# EAGLE design tm-2 (EAGLE 7.5.0)
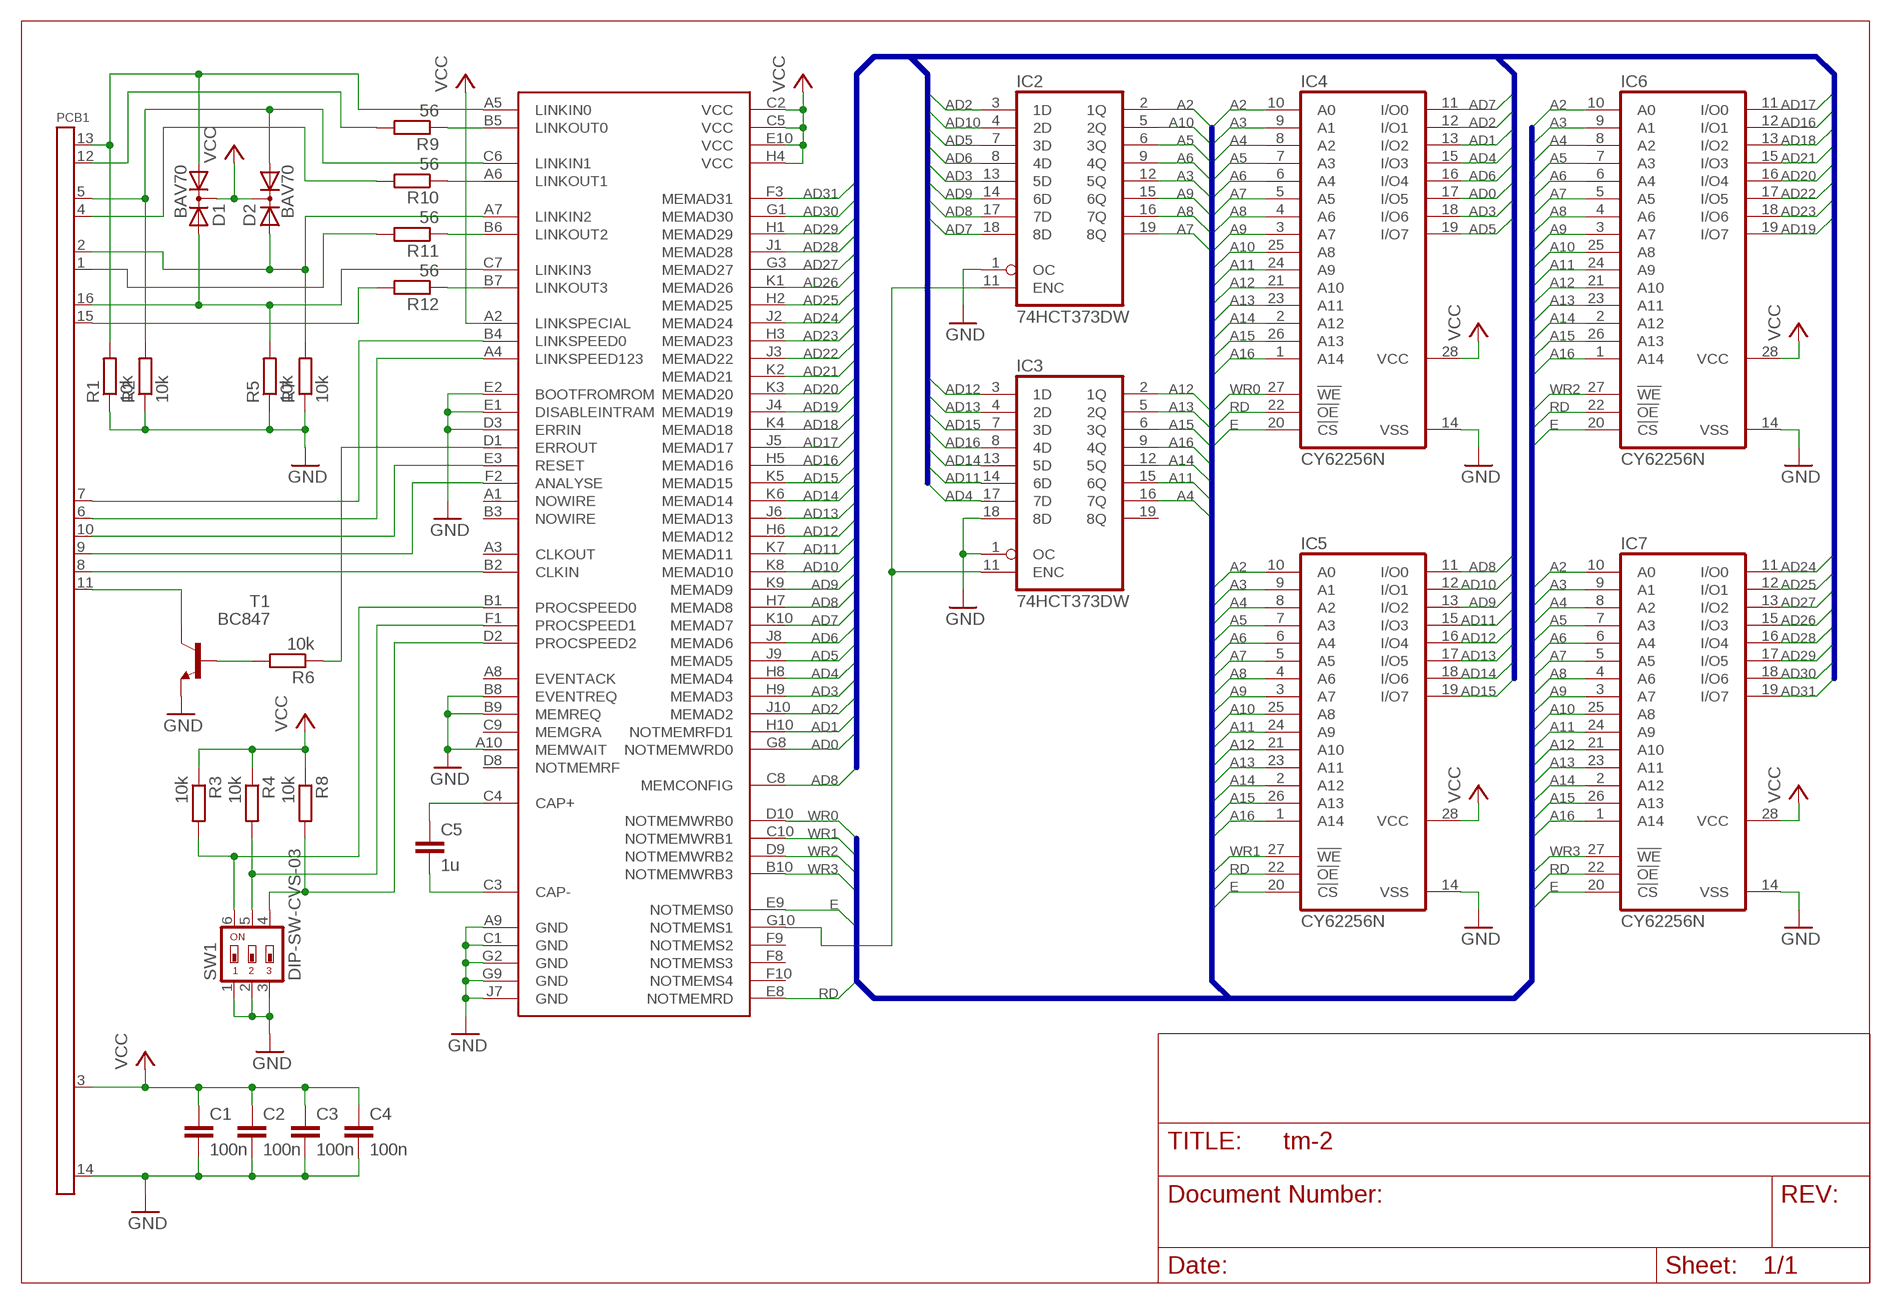
[diagram p0: schematic, sheet 1]

## Parts
C1  100n  C-EUC1206  [C1206]
C2  100n  C-EUC1206  [C1206]
C3  100n  C-EUC1206  [C1206]
C4  100n  C-EUC1206  [C1206]
C5  1u  C-EUC1206  [C1206]
D1  BAV70  DIODE-2AC|CASOT23  [SOT23]
D2  BAV70  DIODE-2AC|CASOT23  [SOT23]
IC1  IMST800  [PGA84]
IC2  74HCT373DW  [SO20W]
IC3  74HCT373DW  [SO20W]
IC4  CY62256N  [SOP28N]
IC5  CY62256N  [SOP28N]
IC6  CY62256N  [SOP28N]
IC7  CY62256N  [SOP28N]
PCB1  TRAM-1-PCB  [TRAM-1-PCB]
R1  10k  R-EU_R1206  [R1206]
R2  10k  R-EU_R1206  [R1206]
R3  10k  R-EU_R1206  [R1206]
R4  10k  R-EU_R1206  [R1206]
R5  10k  R-EU_R1206  [R1206]
R6  10k  R-EU_R1206  [R1206]
R7  10k  R-EU_R1206  [R1206]
R8  10k  R-EU_R1206  [R1206]
R9  56  R-EU_R1206  [R1206]
R10  56  R-EU_R1206  [R1206]
R11  56  R-EU_R1206  [R1206]
R12  56  R-EU_R1206  [R1206]
SW1  DIP-SW-CVS-03  [DIP-SW-CVS-03]
T1  BC847  [SOT23]

## Nets
A2: IC2.2(1Q) IC4.10(A0) IC5.10(A0) IC6.10(A0) IC7.10(A0)
A3: IC2.12(5Q) IC4.9(A1) IC5.9(A1) IC6.9(A1) IC7.9(A1)
A4: IC3.16(7Q) IC4.8(A2) IC5.8(A2) IC6.8(A2) IC7.8(A2)
A5: IC2.6(3Q) IC4.7(A3) IC5.7(A3) IC6.7(A3) IC7.7(A3)
A6: IC2.9(4Q) IC4.6(A4) IC5.6(A4) IC6.6(A4) IC7.6(A4)
A7: IC2.19(8Q) IC4.5(A5) IC5.5(A5) IC6.5(A5) IC7.5(A5)
A8: IC2.16(7Q) IC4.4(A6) IC5.4(A6) IC6.4(A6) IC7.4(A6)
A9: IC2.15(6Q) IC4.3(A7) IC5.3(A7) IC6.3(A7) IC7.3(A7)
A10: IC2.5(2Q) IC4.25(A8) IC5.25(A8) IC6.25(A8) IC7.25(A8)
A11: IC3.15(6Q) IC4.24(A9) IC5.24(A9) IC6.24(A9) IC7.24(A9)
A12: IC3.2(1Q) IC4.21(A10) IC5.21(A10) IC6.21(A10) IC7.21(A10)
A13: IC3.5(2Q) IC4.23(A11) IC5.23(A11) IC6.23(A11) IC7.23(A11)
A14: IC3.12(5Q) IC4.2(A12) IC5.2(A12) IC6.2(A12) IC7.2(A12)
A15: IC3.6(3Q) IC4.26(A13) IC5.26(A13) IC6.26(A13) IC7.26(A13)
A16: IC3.9(4Q) IC4.1(A14) IC5.1(A14) IC6.1(A14) IC7.1(A14)
AD0: IC1.G8(NOTMEMWRD0) IC4.17(I/O5)
AD1: IC1.H10(NOTMEMRFD1) IC4.13(I/O2)
AD2: IC1.J10(MEMAD2) IC2.3(1D) IC4.12(I/O1)
AD3: IC1.H9(MEMAD3) IC2.13(5D) IC4.18(I/O6)
AD4: IC1.H8(MEMAD4) IC3.17(7D) IC4.15(I/O3)
AD5: IC1.J9(MEMAD5) IC2.7(3D) IC4.19(I/O7)
AD6: IC1.J8(MEMAD6) IC2.8(4D) IC4.16(I/O4)
AD7: IC1.K10(MEMAD7) IC2.18(8D) IC4.11(I/O0)
AD8: IC1.C8(MEMCONFIG) IC1.H7(MEMAD8) IC2.17(7D) IC5.11(I/O0)
AD9: IC1.K9(MEMAD9) IC2.14(6D) IC5.13(I/O2)
AD10: IC1.K8(MEMAD10) IC2.4(2D) IC5.12(I/O1)
AD11: IC1.K7(MEMAD11) IC3.14(6D) IC5.15(I/O3)
AD12: IC1.H6(MEMAD12) IC3.3(1D) IC5.16(I/O4)
AD13: IC1.J6(MEMAD13) IC3.4(2D) IC5.17(I/O5)
AD14: IC1.K6(MEMAD14) IC3.13(5D) IC5.18(I/O6)
AD15: IC1.K5(MEMAD15) IC3.7(3D) IC5.19(I/O7)
AD16: IC1.H5(MEMAD16) IC3.8(4D) IC6.12(I/O1)
AD17: IC1.J5(MEMAD17) IC6.11(I/O0)
AD18: IC1.K4(MEMAD18) IC6.13(I/O2)
AD19: IC1.J4(MEMAD19) IC6.19(I/O7)
AD20: IC1.K3(MEMAD20) IC6.16(I/O4)
AD21: IC1.K2(MEMAD21) IC6.15(I/O3)
AD22: IC1.J3(MEMAD22) IC6.17(I/O5)
AD23: IC1.H3(MEMAD23) IC6.18(I/O6)
AD24: IC1.J2(MEMAD24) IC7.11(I/O0)
AD25: IC1.H2(MEMAD25) IC7.12(I/O1)
AD26: IC1.K1(MEMAD26) IC7.15(I/O3)
AD27: IC1.G3(MEMAD27) IC7.13(I/O2)
AD28: IC1.J1(MEMAD28) IC7.16(I/O4)
AD29: IC1.H1(MEMAD29) IC7.17(I/O5)
AD30: IC1.G1(MEMAD30) IC7.18(I/O6)
AD31: IC1.F3(MEMAD31) IC7.19(I/O7)
E: IC1.E9(NOTMEMS0) IC4.20(!CS) IC5.20(!CS) IC6.20(!CS) IC7.20(!CS)
GND: C1.2 C2.2 C3.2 C4.2 IC1.A9(GND) IC1.A10(MEMWAIT) IC1.B8(EVENTREQ) IC1.B9(MEMREQ) IC1.C1(GND) IC1.D3(ERRIN) IC1.E1(DISABLEINTRAM) IC1.E2(BOOTFROMROM) IC1.G2(GND) IC1.G9(GND) IC1.J7(GND) IC2.1(OC) IC3.1(OC) IC3.18(8D) IC4.14(VSS) IC5.14(VSS) IC6.14(VSS) IC7.14(VSS) PCB1.14(GND) R1.1 R2.1 R5.1 R7.1 SW1.1 SW1.2 SW1.3 T1.2(E)
N$1: IC1.G10(NOTMEMS1) IC2.11(ENC) IC3.11(ENC)
N$2: IC1.B5(LINKOUT0) R9.1
N$3: C5.1 IC1.C4(CAP+)
N$4: C5.2 IC1.C3(CAP-)
N$5: IC1.A6(LINKOUT1) R10.1
N$6: IC1.B6(LINKOUT2) R11.1
N$7: IC1.B7(LINKOUT3) R12.1
N$8: PCB1.4(LINK1OUT) R10.2
N$9: PCB1.12(LINK0OUT) R9.2
N$10: D2.2(A2) IC1.A7(LINKIN2) PCB1.2(LINK2IN) R7.2
N$11: D2.1(A1) IC1.C6(LINKIN1) PCB1.5(LINK1IN) R2.2
N$12: D1.1(A1) IC1.A5(LINKIN0) PCB1.13(LINK0IN) R1.2
N$13: PCB1.1(LINK2OUT) R11.2
N$14: D1.2(A2) IC1.C7(LINKIN3) PCB1.16(LINK3IN) R5.2
N$15: PCB1.15(LINK3OUT) R12.2
N$17: IC1.D1(ERROUT) R6.1
N$18: IC1.E3(RESET) PCB1.10(RESET)
N$19: IC1.F2(ANALYSE) PCB1.9(ANALYSE)
N$20: IC1.B2(CLKIN) PCB1.8(CLOCKIN)
N$21: IC1.A4(LINKSPEED123) PCB1.6(LINKSPEEDA)
N$22: IC1.B4(LINKSPEED0) PCB1.7(LINKSPEEDB)
N$23: IC1.B1(PROCSPEED0) R3.2 SW1.6
N$24: PCB1.11(NOTERROR) T1.3(C)
N$25: R6.2 T1.1(B)
N$29: IC1.F1(PROCSPEED1) R4.2 SW1.5
N$30: IC1.D2(PROCSPEED2) R8.2 SW1.4
RD: IC1.E8(NOTMEMRD) IC4.22(!OE) IC5.22(!OE) IC6.22(!OE) IC7.22(!OE)
VCC: C1.1 C2.1 C3.1 C4.1 D1.3(C) D2.3(C) IC1.A2(LINKSPECIAL) IC1.C2(VCC) IC1.C5(VCC) IC1.E10(VCC) IC1.H4(VCC) IC4.28(VCC) IC5.28(VCC) IC6.28(VCC) IC7.28(VCC) PCB1.3(VCC) R3.1 R4.1 R8.1
WR0: IC1.D10(NOTMEMWRB0) IC4.27(!WE)
WR1: IC1.C10(NOTMEMWRB1) IC5.27(!WE)
WR2: IC1.D9(NOTMEMWRB2) IC6.27(!WE)
WR3: IC1.B10(NOTMEMWRB3) IC7.27(!WE)
Unconnected: IC1.A1(NOWIRE) IC1.A3(CLKOUT) IC1.A8(EVENTACK) IC1.B3(NOWIRE) IC1.C9(MEMGRA) IC1.D8(NOTMEMRF) IC1.F8(NOTMEMS3) IC1.F9(NOTMEMS2) IC1.F10(NOTMEMS4) IC3.19(8Q)

## Buses
AD[0..31]
A[2..17],RD,WR[0..3],E

## Power pins joined to a net without a drawn wire
GND: IC2.10(GND) IC3.10(GND)
VCC: IC2.20(VCC) IC3.20(VCC)

## Library data of the parts
C1-C5 = rcl:C-EU: CAPACITOR, European symbol
D1 D2 = diode:DIODE-2AC|CA: Dual DIODE Anode-Cathode|Cathode-Anode
IC1 = Transputer:IMST800
IC2 IC3 = 74xx-eu:74*373: Octal D type transparent LATCH, edge triggered
IC4-IC7 = Transputer:CY62256N
PCB1 = Transputer:TRAM-1-PCB
R1-R12 = rcl:R-EU_: RESISTOR, European symbol
SW1 = Transputer:DIP-SW-CVS-03
T1 = transistor:BC847: NPN TRANSISTOR

## Board
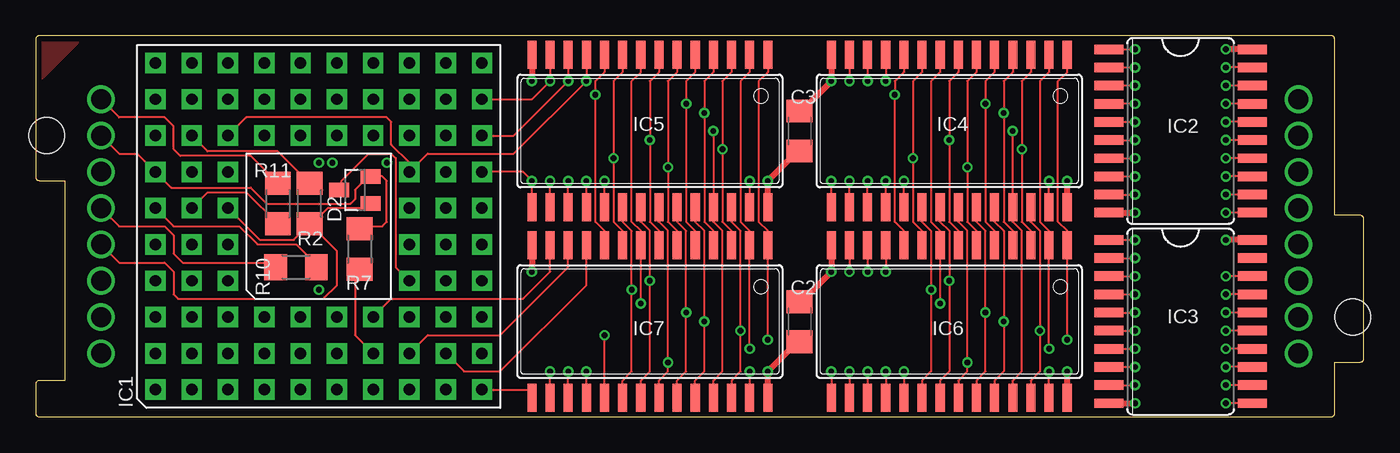
[diagram p1: board, top side]
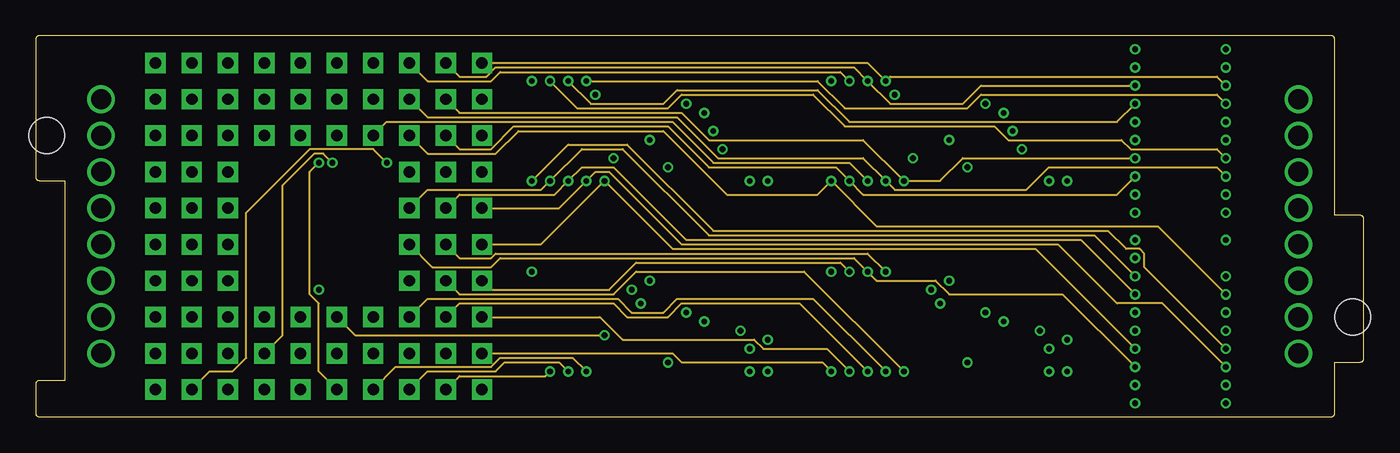
[diagram p2: board, inner layer Route2]
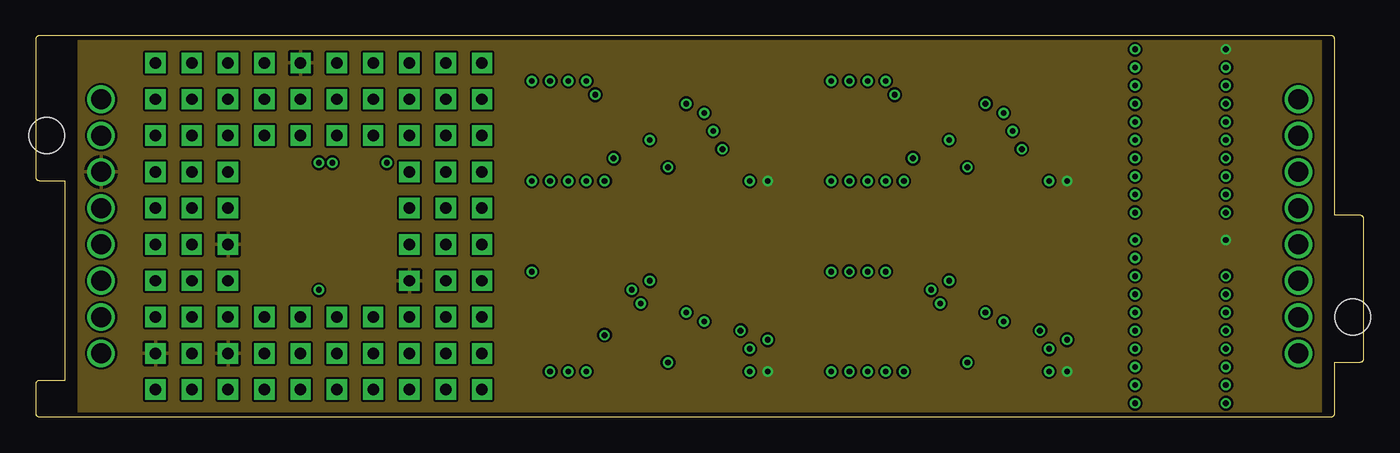
[diagram p3: board, inner layer Route3]
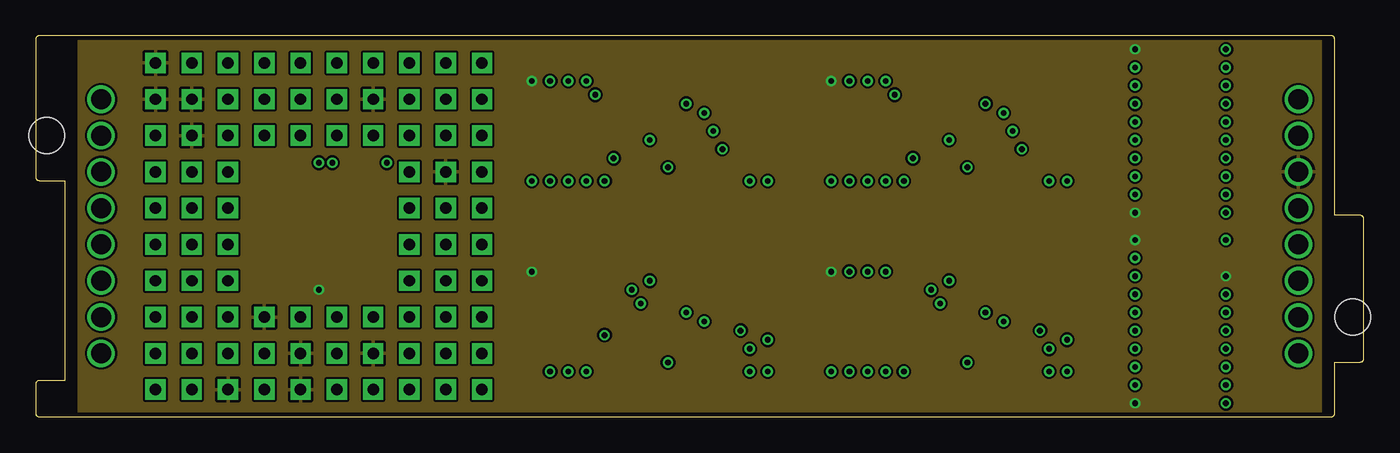
[diagram p4: board, inner layer Route14]
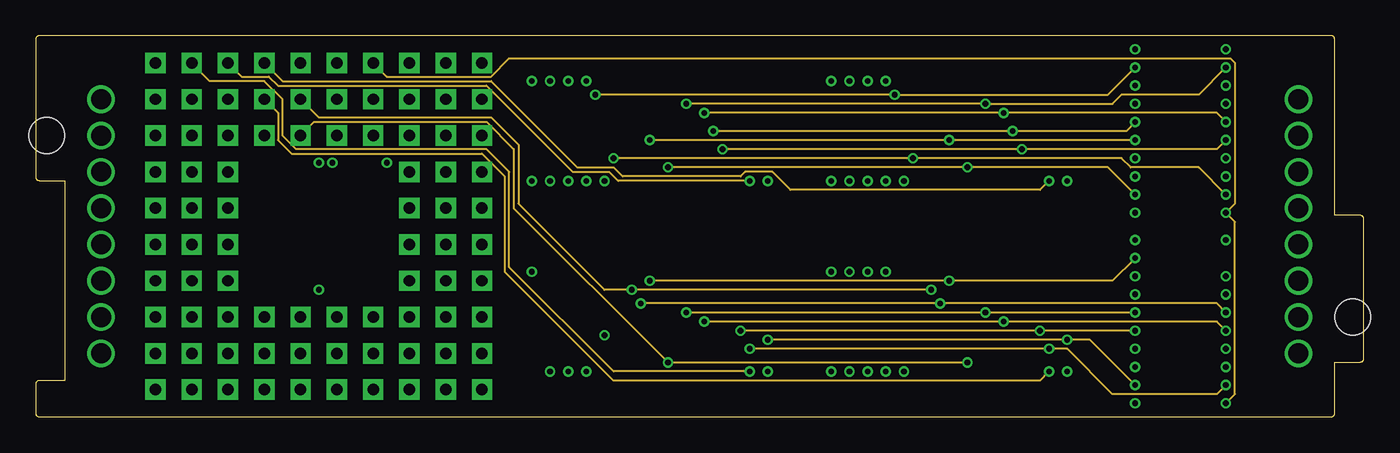
[diagram p5: board, inner layer Route15]
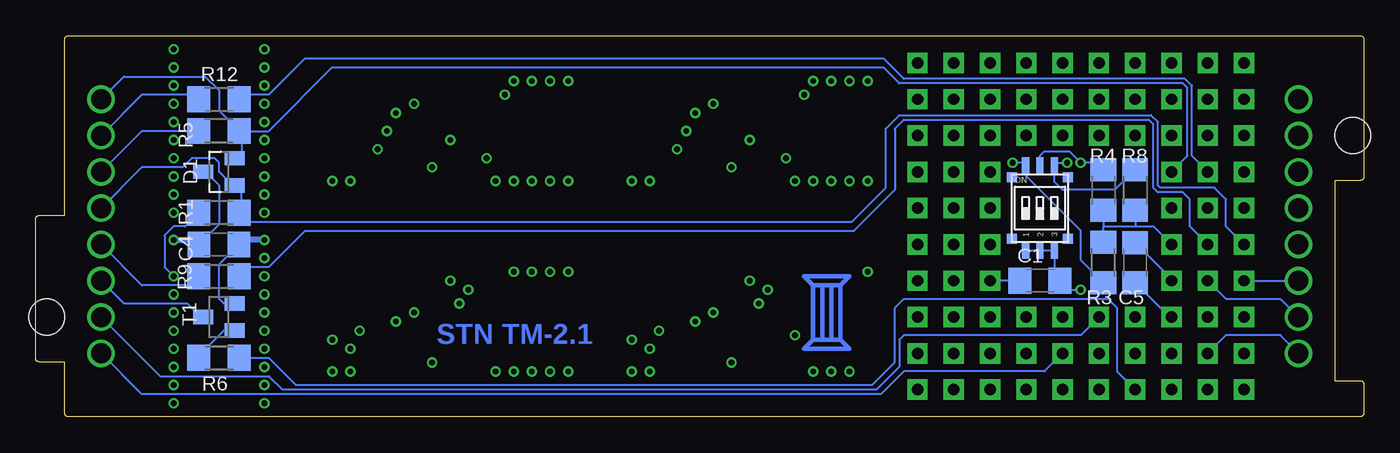
[diagram p6: board, bottom side, seen from below]

Size 92.96 x 26.67 mm. Coordinates in mm from the lower left corner, seen from the top.
Copper layers (1+2+3*14+15+16): Top 0.035mm / dielectric 0.2mm / Route2 0.035mm / dielectric 0.36mm / Route3 0.035mm / dielectric 0.28mm / Route14 0.035mm / dielectric 0.36mm / Route15 0.035mm / dielectric 0.2mm / Bottom 0.035mm
Design rules "PCB-POOL Standard_ML6": minimum track width 0.15mm, minimum drill 0.3mm, track to track 0.15mm, track to pad 0.15mm, pad to pad 0.15mm, via to via 0.15mm, smd to smd 0.15mm, copper to edge 0.3mm, drill to drill 0.2mm, minimum pad ring 0.2mm, minimum via ring 0.15mm, stop-mask expansion 0.03mm, vias tented up to drill 0mil, thermal gap 0.2mm

### Footprints (pad centres in the part's own frame; a part is rotated, then mirrored left to right if it is on the bottom)
C1206 = smd 1.6 x 1.8: 1 -1.4,0; 2 1.4,0
SOT23 = smd 1 x 1.4: 1 -0.95,-1.1; 2 0.95,-1.1; 3 0,1.1
PGA84 = drill 0.8 pad 1.422 square: A1 0,0; A2 2.54,0; A3 5.08,0; A4 7.62,0; A5 10.16,0; A6 12.7,0; A7 15.24,0; A8 17.78,0; A9 20.32,0; A10 22.86,0; B1 0,-2.54; B2 2.54,-2.54; B3 5.08,-2.54; B4 7.62,-2.54; B5 10.16,-2.54; B6 12.7,-2.54; B7 15.24,-2.54; B8 17.78,-2.54; B9 20.32,-2.54; B10 22.86,-2.54; C1 0,-5.08; C2 2.54,-5.08; C3 5.08,-5.08; C4 7.62,-5.08; C5 10.16,-5.08; C6 12.7,-5.08; C7 15.24,-5.08; C8 17.78,-5.08; C9 20.32,-5.08; C10 22.86,-5.08; D1 0,-7.62; D2 2.54,-7.62; D3 5.08,-7.62; D8 17.78,-7.62; D9 20.32,-7.62; D10 22.86,-7.62; E1 0,-10.16; E2 2.54,-10.16; E3 5.08,-10.16; E8 17.78,-10.16; E9 20.32,-10.16; E10 22.86,-10.16; F1 0,-12.7; F2 2.54,-12.7; F3 5.08,-12.7; F8 17.78,-12.7; F9 20.32,-12.7; F10 22.86,-12.7; G1 0,-15.24; G2 2.54,-15.24; G3 5.08,-15.24; G8 17.78,-15.24; G9 20.32,-15.24; G10 22.86,-15.24; H1 0,-17.78; H2 2.54,-17.78; H3 5.08,-17.78; H4 7.62,-17.78; H5 10.16,-17.78; H6 12.7,-17.78; H7 15.24,-17.78; H8 17.78,-17.78; H9 20.32,-17.78; H10 22.86,-17.78; J1 0,-20.32; J2 2.54,-20.32; J3 5.08,-20.32; J4 7.62,-20.32; J5 10.16,-20.32; J6 12.7,-20.32; J7 15.24,-20.32; J8 17.78,-20.32; J9 20.32,-20.32; J10 22.86,-20.32; K1 0,-22.86; K2 2.54,-22.86; K3 5.08,-22.86; K4 7.62,-22.86; K5 10.16,-22.86; K6 12.7,-22.86; K7 15.24,-22.86; K8 17.78,-22.86; K9 20.32,-22.86; K10 22.86,-22.86
SO20W = smd 0.66 x 2.032: 1 -5.715,-5.029; 2 -4.445,-5.029; 3 -3.175,-5.029; 4 -1.905,-5.029; 5 -0.635,-5.029; 6 0.635,-5.029; 7 1.905,-5.029; 8 3.175,-5.029; 9 4.445,-5.029; 10 5.715,-5.029; 11 5.715,5.029; 12 4.445,5.029; 13 3.175,5.029; 14 1.905,5.029; 15 0.635,5.029; 16 -0.635,5.029; 17 -1.905,5.029; 18 -3.175,5.029; 19 -4.445,5.029; 20 -5.715,5.029
SOP28N = smd 0.635 x 1.956: 1 -8.255,-5.334; 2 -6.985,-5.334; 3 -5.715,-5.334; 4 -4.445,-5.334; 5 -3.175,-5.334; 6 -1.905,-5.334; 7 -0.635,-5.334; 8 0.635,-5.334; 9 1.905,-5.334; 10 3.175,-5.334; 11 4.445,-5.334; 12 5.715,-5.334; 13 6.985,-5.334; 14 8.255,-5.334; 15 8.255,5.334; 16 6.985,5.334; 17 5.715,5.334; 18 4.445,5.334; 19 3.175,5.334; 20 1.905,5.334; 21 0.635,5.334; 22 -0.635,5.334; 23 -1.905,5.334; 24 -3.175,5.334; 25 -4.445,5.334; 26 -5.715,5.334; 27 -6.985,5.334; 28 -8.255,5.334
TRAM-1-PCB = drill 1.4 pad 1.93: 1 -17.78,0; 2 -15.24,0; 3 -12.7,0; 4 -10.16,0; 5 -7.62,0; 6 -5.08,0; 7 -2.54,0; 8 0,0; 9 0,83.82; 10 -2.54,83.82; 11 -5.08,83.82; 12 -7.62,83.82; 13 -10.16,83.82; 14 -12.7,83.82; 15 -15.24,83.82; 16 -17.78,83.82 | hole 2.5: -15.24,-3.81; -2.54,87.63
R1206 = smd 1.6 x 1.803: 1 -1.422,0; 2 1.422,0
DIP-SW-CVS-03 = smd 0.5 x 1.2: 1 -1,-2.95; 2 0,-2.95; 3 1,-2.95; 4 1,2.95; 5 0,2.95; 6 -1,2.95 | smd 0.7 x 0.7: P$1 -1.95,-2.15; P$2 -1.95,2.15; P$3 1.95,2.15; P$4 1.95,-2.15

### Placement (x,y rotation side)
C1  22.67,9.53 0 bottom
C2  53.47,6.67 90 top
C3  53.47,20 90 top
C4  80.14,12.07 0 bottom
C5  16,10.79 270 bottom
D1  80.14,17.14 90 bottom
D2  22.35,15.88 90 top
IC1  8.38,1.91 90 top
IC2  80.14,20 270 top
IC3  80.14,6.67 270 top
IC4  63.94,20 180 top
IC5  42.99,20 180 top
IC6  63.94,6.67 180 top
IC7  42.99,6.67 180 top
PCB1  4.57,4.45 270 top
R1  80.14,14.29 0 bottom
R2  19.18,14.92 270 top
R3  18.22,10.79 270 bottom
R4  18.22,15.88 90 bottom
R5  80.14,20 0 bottom
R6  80.14,4.13 180 bottom
R7  22.67,11.75 90 top
R8  16,15.88 90 bottom
R9  80.14,9.84 180 bottom
R10  18.22,10.48 180 top
R11  16.95,14.92 90 top
R12  80.14,22.23 180 bottom
SW1  22.67,14.61 0 bottom
T1  80.14,6.99 90 bottom
U$2  [LOGO]  37.59,7.3 0 bottom

### Tracks (layer width: path | path; a pad name or v marks a point on that pad's centre or on a via)
A2  (via drill 0.4)
  Top 0.152: IC2.2 v76.96,24.45 | IC5.10 39.81,24.13 39.18,23.5 v39.18,22.54 39.18,13.65 39.81,13.02 IC7.10 | IC4.10 60.77,24.13 60.13,23.5 v60.13,22.54 60.13,13.65 60.77,13.02 IC6.10
  Route15 0.152: v76.96,24.45 75.06,22.54 v60.13,22.54 v39.18,22.54
A3  (via drill 0.4)
  Top 0.152: IC2.12 v83.31,15.56 | IC5.9 41.09,24.13 40.45,23.5 v40.45,18.1 40.45,13.65 41.09,13.02 IC7.9 | IC4.9 62.04,24.13 61.41,23.5 v61.41,18.1 61.41,13.65 62.04,13.02 IC6.9
  Route15 0.152: v83.31,15.56 81.41,17.46 76.64,17.46 76.01,18.1 v61.41,18.1 v40.45,18.1
A4  (via drill 0.4)
  Top 0.152: IC3.16 v83.31,7.3 | IC4.8 63.31,24.13 62.67,23.5 62.67,13.65 63.31,13.02 IC6.8 v63.31,7.94 | v42.35,7.94 IC7.8 42.35,13.02 41.72,13.65 41.72,23.5 42.35,24.13 IC5.8
  Route15 0.152: v83.31,7.3 82.68,7.94 v63.31,7.94 v42.35,7.94
A5  (via drill 0.4)
  Top 0.152: IC2.6 v76.96,19.37 | IC5.7 43.62,24.13 42.99,23.5 v42.99,19.37 42.99,13.65 43.62,13.02 IC7.7 | IC4.7 64.58,24.13 63.95,23.5 v63.95,19.37 63.95,13.65 64.58,13.02 IC6.7
  Route15 0.152: v76.96,19.37 v63.95,19.37 v42.99,19.37
A6  (via drill 0.4)
  Top 0.152: IC2.9 v76.96,15.56 | IC5.6 44.89,24.13 44.26,23.5 v44.26,17.46 44.26,13.65 44.89,13.02 IC7.6 | IC4.6 65.85,24.13 65.21,23.5 v65.21,17.46 65.21,13.65 65.85,13.02 IC6.6
  Route15 0.152: v76.96,15.56 75.06,17.46 v65.21,17.46 v44.26,17.46
A7  (via drill 0.4)
  Top 0.152: IC2.19 v83.31,24.45 | IC5.5 46.17,24.13 45.53,23.5 v45.53,21.91 45.53,13.65 46.17,13.02 IC7.5 | IC4.5 67.12,24.13 66.48,23.5 v66.48,21.91 66.48,13.65 67.12,13.02 IC6.5
  Route15 0.152: v83.31,24.45 81.41,22.54 76.01,22.54 75.37,21.91 v66.48,21.91 v45.53,21.91
A8  (via drill 0.4)
  Top 0.152: IC2.16 v83.31,20.64 | IC5.4 47.43,24.13 46.8,23.5 v46.8,21.27 46.8,13.65 47.43,13.02 IC7.4 | IC4.4 68.39,24.13 67.75,23.5 v67.75,21.27 67.75,13.65 68.39,13.02 IC6.4
  Route15 0.152: v83.31,20.64 82.68,21.27 v67.75,21.27 v46.8,21.27
A9  (via drill 0.4)
  Top 0.152: IC2.15 v83.31,19.37 | IC5.3 48.71,24.13 48.07,23.5 v48.07,18.73 48.07,13.65 48.71,13.02 IC7.3 | IC4.3 69.66,24.13 69.03,23.5 v69.03,18.73 69.03,13.65 69.66,13.02 IC6.3
  Route15 0.152: v83.31,19.37 82.68,18.73 v69.03,18.73 v48.07,18.73
A10  (via drill 0.4)
  Top 0.152: IC2.5 v76.96,20.64 | IC7.25 47.43,2.54 48.07,3.18 48.07,13.02 47.43,13.65 IC5.25 v47.43,20 | IC6.25 68.39,2.54 69.03,3.18 69.03,13.02 68.39,13.65 IC4.25 v68.39,20
  Route15 0.152: v76.96,20.64 76.33,20 v68.39,20 v47.43,20
A11  (via drill 0.4)
  Top 0.152: IC3.15 v83.31,6.03 | IC5.24 46.17,13.65 46.8,13.02 v46.8,6.67 46.8,3.18 46.17,2.54 IC7.24 | IC4.24 67.12,13.65 67.75,13.02 v67.75,6.67 67.75,3.18 67.12,2.54 IC6.24
  Route15 0.152: v83.31,6.03 82.68,6.67 v67.75,6.67 v46.8,6.67
A12  (via drill 0.4)
  Top 0.152: IC3.2 v76.96,11.11 | IC5.21 42.35,13.65 42.99,13.02 v42.99,9.53 42.99,3.18 42.35,2.54 IC7.21 | IC4.21 63.31,13.65 63.95,13.02 v63.95,9.53 63.95,3.18 63.31,2.54 IC6.21
  Route15 0.152: v76.96,11.11 75.37,9.53 v63.95,9.53 v42.99,9.53
A13  (via drill 0.4)
  Top 0.152: IC3.5 v76.96,7.3 | IC5.23 44.89,13.65 45.53,13.02 v45.53,7.3 45.53,3.18 44.89,2.54 IC7.23 | IC4.23 65.85,13.65 66.48,13.02 v66.48,7.3 66.48,3.18 65.85,2.54 IC6.23
  Route15 0.152: v76.96,7.3 v66.48,7.3 v45.53,7.3
A14  (via drill 0.4)
  Top 0.152: IC3.12 v83.31,2.22 | IC4.2 70.93,24.13 70.29,23.5 70.29,13.65 70.93,13.02 IC6.2 v70.93,4.76 | v49.98,4.76 IC7.2 49.98,13.02 49.34,13.65 49.34,23.5 49.98,24.13 IC5.2
  Route15 0.152: v83.31,2.22 82.68,1.59 75.37,1.59 72.2,4.76 v70.93,4.76 v49.98,4.76
A15  (via drill 0.4)
  Top 0.152: IC3.6 v76.96,6.03 | IC5.26 48.71,13.65 49.34,13.02 v49.34,6.03 49.34,3.18 48.71,2.54 IC7.26 | IC4.26 69.66,13.65 70.29,13.02 v70.29,6.03 70.29,3.18 69.66,2.54 IC6.26
  Route15 0.152: v76.96,6.03 v70.29,6.03 v49.34,6.03
A16  (via drill 0.4)
  Top 0.152: IC3.9 v76.96,2.22 | IC4.1 72.2,24.13 71.56,23.5 71.56,13.65 72.2,13.02 IC6.1 v72.2,5.4 | v51.24,5.4 IC7.1 51.24,13.02 50.61,13.65 50.61,23.5 51.24,24.13 IC5.1
  Route15 0.152: v76.96,2.22 73.79,5.4 v72.2,5.4 v51.24,5.4
AD0  (via drill 0.4)
  Top 0.152: IC4.17 v58.23,16.51
  Route2 0.152: IC1.G8 24.57,20.64 44.58,20.64 47.43,17.78 56.96,17.78 v58.23,16.51
AD1  (via drill 0.4)
  Top 0.152: IC4.13 v56.96,23.5
  Route2 0.152: IC1.H10 27.43,23.5 31.88,23.5 32.51,24.13 56.32,24.13 v56.96,23.5
AD2  (via drill 0.4)
  Top 0.152: v76.96,23.18 IC2.3 | IC4.12 v58.23,23.5
  Route2 0.152: IC1.J10 29.65,23.81 31.56,23.81 32.19,24.45 57.28,24.45 v58.23,23.5 59.82,21.91 64.9,21.91 66.17,23.18 v76.96,23.18
AD3  (via drill 0.4)
  Top 0.152: IC2.13 v83.31,16.83 | IC4.18 v59.5,16.51
  Route2 0.152: IC1.H9 27.43,20.96 44.89,20.96 47.75,18.1 57.91,18.1 v59.5,16.51 60.13,15.88 69.34,15.88 70.93,17.46 82.68,17.46 v83.31,16.83
AD4  (via drill 0.4)
  Top 0.152: IC3.17 v83.31,8.57 | IC4.15 v55.69,16.51
  Route2 0.152: IC1.H8 27.43,18.41 32.19,18.41 33.78,20 43.94,20 48.39,15.56 54.74,15.56 v55.69,16.51 58.86,13.34 78.55,13.34 v83.31,8.57
AD5  (via drill 0.4)
  Top 0.152: IC2.7 v76.96,18.1 | IC4.19 v60.77,16.51
  Route2 0.152: IC1.J9 29.65,21.27 45.21,21.27 47.12,19.37 57.91,19.37 v60.77,16.51 63.31,16.51 64.9,18.1 v76.96,18.1
AD6  (via drill 0.4)
  Top 0.152: IC2.8 v76.96,16.83 | IC4.16 v56.96,16.51
  Route2 0.152: IC1.J8 29.65,18.73 31.88,18.73 33.46,20.32 44.26,20.32 47.12,17.46 56.01,17.46 v56.96,16.51 57.91,15.56 75.69,15.56 v76.96,16.83
AD7  (via drill 0.4)
  Top 0.152: IC2.18 v83.31,23.18 | IC4.11 v59.5,23.5
  Route2 0.152: IC1.K10 58.23,24.77 v59.5,23.5 59.82,23.81 82.68,23.81 v83.31,23.18
AD8  (via drill 0.4)
  Top 0.152: IC1.C8 14.73,20.96 24.57,20.96 24.89,20.64 24.89,19.05 26.16,17.78 IC1.H7 27.43,18.41 33.46,18.41 v38.54,23.5 IC5.11 | IC2.17 v83.31,21.91
  Route2 0.152: v38.54,23.5 54.74,23.5 56.64,21.59 65.21,21.59 66.17,22.54 82.68,22.54 v83.31,21.91
AD9  (via drill 0.4)
  Top 0.152: IC1.K9 34.73,22.23 v36.01,23.5 IC5.13 | IC2.14 v83.31,18.1
  Route2 0.152: v36.01,23.5 37.91,21.59 44.26,21.59 45.21,22.54 54.42,22.54 56.64,20.32 67.12,20.32 68.07,19.37 76.01,19.37 76.64,18.73 82.68,18.73 v83.31,18.1
AD10  (via drill 0.4)
  Top 0.152: IC1.K8 33.46,19.69 v37.28,23.5 IC5.12 | v76.96,21.91 IC2.4
  Route2 0.152: v37.28,23.5 38.86,21.91 43.94,21.91 44.89,22.86 54.74,22.86 56.96,20.64 75.69,20.64 v76.96,21.91
AD11  (via drill 0.4)
  Top 0.152: IC1.K7 34.1,17.14 v34.73,16.51 IC5.15 | IC3.14 v83.31,4.76
  Route2 0.152: v34.73,16.51 37.28,19.05 41.4,19.05 47.43,13.02 75.06,13.02 76.33,11.75 77.28,11.75 77.6,11.43 77.6,10.48 v83.31,4.76
AD12  (via drill 0.4)
  Top 0.152: IC3.3 v76.96,9.84 | IC5.16 v36.01,16.51
  Route2 0.152: IC1.H6 27.43,15.88 35.37,15.88 v36.01,16.51 38.23,18.73 41.09,18.73 47.12,12.7 74.1,12.7 v76.96,9.84
AD13  (via drill 0.4)
  Top 0.152: IC3.4 v76.96,8.57 | IC5.17 v37.28,16.51
  Route2 0.152: IC1.J6 29.65,15.56 36.32,15.56 v37.28,16.51 38.23,17.46 40.45,17.46 45.53,12.38 73.15,12.38 v76.96,8.57
AD14  (via drill 0.4)
  Top 0.152: IC3.13 v83.31,3.49 | IC5.18 v38.54,16.51
  Route2 0.152: IC1.K6 36.64,14.61 v38.54,16.51 39.18,17.14 40.13,17.14 45.21,12.07 71.56,12.07 75.69,7.94 78.87,7.94 v83.31,3.49
AD15  (via drill 0.4)
  Top 0.152: IC3.7 v76.96,4.76 | IC5.19 v39.81,16.51
  Route2 0.152: IC1.K5 35.37,12.07 v39.81,16.51 44.58,11.75 69.98,11.75 v76.96,4.76
AD16  (via drill 0.4)
  Top 0.152: IC3.8 v76.96,3.49 | IC6.12 v58.23,10.16
  Route2 0.152: IC1.H5 27.75,10.48 31.88,10.48 32.51,11.11 57.28,11.11 v58.23,10.16 58.86,9.53 62.99,9.53 63.95,8.57 71.88,8.57 v76.96,3.49
AD17  (via drill 0.4)
  Top 0.152: IC6.11 v59.5,10.16
  Route2 0.152: IC1.J5 29.65,11.11 31.88,11.11 32.19,11.43 58.23,11.43 v59.5,10.16
AD18  (via drill 0.4)
  Top 0.152: IC6.13 v56.96,10.16
  Route2 0.152: IC1.K4 31.88,8.89 40.13,8.89 42.04,10.79 56.32,10.79 v56.96,10.16
AD19  (via drill 0.4)
  Top 0.152: v60.77,3.18 IC6.19
  Route2 0.152: IC1.J4 29.65,8.57 40.45,8.57 42.04,10.16 53.78,10.16 v60.77,3.18
AD20  (via drill 0.4)
  Top 0.152: v56.96,3.18 IC6.16
  Route2 0.152: IC1.K3 39.5,6.99 41.09,5.4 50.29,5.4 50.93,4.76 55.37,4.76 v56.96,3.18
AD21  (via drill 0.4)
  Top 0.152: v55.69,3.18 IC6.15
  Route2 0.152: IC1.K2 44.58,4.45 45.21,3.81 55.05,3.81 v55.69,3.18
AD22  (via drill 0.4)
  Top 0.152: v58.23,3.18 IC6.17
  Route2 0.152: IC1.J3 29.65,7.94 40.45,7.94 41.4,6.99 44.26,6.99 45.21,7.94 53.47,7.94 v58.23,3.18
AD23  (via drill 0.4)
  Top 0.152: v59.5,3.18 IC6.18
  Route2 0.152: IC1.H3 27.43,8.26 40.77,8.26 41.72,7.3 43.94,7.3 44.89,8.26 54.42,8.26 v59.5,3.18
AD24
  Top 0.152: IC1.J2 29.97,3.18 32.51,3.18 38.54,9.21 IC7.11
AD25
  Top 0.152: IC1.H2 27.43,5.71 32.51,5.71 37.28,10.48 IC7.12
AD26
  Top 0.152: IC1.K1 34.73,1.91 IC7.15
AD27
  Top 0.152: IC1.G3 24.89,8.26 34.1,8.26 36.01,10.16 IC7.13
AD28  (via drill 0.4)
  Top 0.152: IC7.16 v36.01,3.18
  Route2 0.152: IC1.J1 29.65,2.86 35.69,2.86 v36.01,3.18
AD29  (via drill 0.4)
  Top 0.152: IC7.17 v37.28,3.18
  Route2 0.152: IC1.H1 27.43,3.18 32.19,3.18 32.83,3.81 36.64,3.81 v37.28,3.18
AD30  (via drill 0.4)
  Top 0.152: IC7.18 v38.54,3.18
  Route2 0.152: IC1.G1 25.21,3.49 31.88,3.49 32.51,4.13 37.59,4.13 v38.54,3.18
AD31  (via drill 0.4)
  Top 0.152: IC7.19 v39.81,5.71
  Route2 0.152: IC1.F3 22.35,5.71 v39.81,5.71
E  (via drill 0.4)
  Top 0.152: IC5.20 41.09,13.65 41.72,13.02 v41.72,8.89 41.72,3.18 41.09,2.54 IC7.20 | IC4.20 62.04,13.65 62.67,13.02 v62.67,8.89 62.67,3.18 62.04,2.54 IC6.20
  Route15 0.152: v62.67,8.89 v41.72,8.89 39.81,8.89 33.78,14.92 33.78,19.05 31.88,20.96 19.81,20.96 IC1.E9
GND  (via drill 0.4)
  Top 0.152: 53.47,8.26 C2.2 53.6,8.07 | 53.6,21.4 C3.2 | IC3.1 v76.96,12.38 | IC3.18 v83.31,9.84 | IC2.1 v76.96,25.72 | IC1.B8 12.03,18.57 16.95,18.57 R2.1 | R7.1 22.35,10.01 22.35,5.71 IC1.G2
  Top 0.406: 53.6,21.4 v55.69,23.5 IC4.14 | 53.6,8.07 v55.69,10.16 IC6.14 | IC2.10 v76.96,14.29 | IC3.10 v76.96,0.95 | IC5.14 v34.73,23.5 | IC7.14 v34.73,10.16
  Bottom 0.152: 78.23,12.38 78.55,12.07 C4.2 80.14,10.66 80.14,8.26 79.82,7.94 T1.2 | R1.1 82.51,13.34 83.31,13.34 83.95,12.7 83.95,10.48 v83.31,9.84 | R5.1 85.53,20 PCB1.14 | 20.45,8.89 v19.81,8.89 20.63,8.89 C1.2 21.67,9.93 SW1.3 SW1.2 SW1.1
  Bottom 0.406: v76.96,12.38 78.23,12.38
  pour Route14 (isolate 0.127): 2.98,0 89.98,0 89.98,26.67 2.98,26.67
N$1  (via drill 0.4)
  Top 0.152: IC2.11 v83.31,14.29 | IC3.11 v83.31,0.95
  Route15 0.152: IC1.G10 24.57,23.81 31.88,23.81 33.15,25.08 83.63,25.08 83.95,24.77 83.95,14.92 v83.31,14.29 83.95,13.65 83.95,1.59 v83.31,0.95
N$2
  Bottom 0.152: 78.08,9.21 R9.1 78.72,10.31 78.55,10.48 76.64,10.48 74.1,13.02 35.69,13.02 32.83,15.88 32.83,20.16 32.19,20.8 15.05,20.8 14.73,20.48 14.73,16.03 14.41,15.72 12.67,15.72 12.19,15.24 12.19,13.34 IC1.B5
N$3
  Bottom 0.152: C5.1 13.46,9.66 IC1.C4
N$4
  Bottom 0.152: C5.2 13.59,6.99 IC1.C3
N$5
  Top 0.152: IC1.A6 9.65,13.34 14.26,13.34 15.53,12.07 18.22,12.07 19.65,10.64 R10.1
N$6
  Top 0.152: IC1.B6 12.03,15.72 14.74,15.72 R11.1
N$7
  Bottom 0.152: IC1.B7 12.03,18.26 12.03,23.18 12.51,23.65 32.19,23.65 33.62,25.08 74.1,25.08 76.64,22.54 78.23,22.54 78.55,22.23 R12.1
N$8
  Top 0.152: PCB1.4 5.84,13.34 9.02,13.34 9.65,12.7 9.65,11.43 10.29,10.79 16.48,10.79 R10.2
N$9
  Bottom 0.152: R9.2 82.19,9.21 85.53,9.21 PCB1.12
N$10
  Top 0.152: PCB1.2 5.84,18.41 7.11,18.41 IC1.A7 9.49,16.03 15.05,16.03 16.16,14.92 22.03,14.92 22.35,15.24 22.35,15.88 23.3,16.83 D2.2 24.26,16.83 24.57,16.51 24.57,13.65 24.26,13.34 23.15,13.34 22.99,13.17 R7.2
N$11
  Top 0.152: D2.1 23.13,14.61 20.45,14.61 19.34,13.5 R2.2 | IC1.C6 15.68,12.38 18.06,12.38 R2.2 | PCB1.5 5.84,10.79 9.02,10.79 9.65,10.16 9.65,8.57 9.97,8.26 20.13,8.26 21.08,9.21 21.08,11.6 R2.2
N$12
  Bottom 0.152: PCB1.13 85.53,17.46 82.68,17.46 82.04,18.1 80.45,18.1 80.14,17.78 80.14,17.14 79.18,16.19 D1.1 78.55,16.2 78.55,16.19 78.55,14.92 78.08,14.92 R1.2 78.72,14.14 78.23,13.65 35.85,13.65 33.46,16.03 33.46,20.16 32.51,21.11 14.89,21.11 14.41,20.64 14.41,16.19 14.26,16.03 10.45,16.03 9.65,15.24 9.65,13.34 IC1.A5
N$13
  Top 0.152: R11.2 15.04,18.26 10.13,18.26 9.65,18.73 9.65,20.32 9.02,20.96 5.84,20.96 PCB1.1
N$14
  Bottom 0.152: D1.2 78.87,18.09 78.55,18.41 78.55,19.84 R5.2 | IC1.C7 12.35,18.26 12.35,23.02 12.67,23.34 32.51,23.34 33.62,24.45 72.2,24.45 76.64,20 R5.2 | PCB1.16 86.81,23.81 81.09,23.81 80.14,22.86 80.14,21.43 R5.2
N$15
  Bottom 0.152: R12.2 81.88,22.54 85.53,22.54 PCB1.15
N$16
  pour Top: 0.44,26.19 0.44,23.65 2.98,26.19
N$17
  Bottom 0.152: R6.1 76.64,4.13 74.74,2.22 34.42,2.22 32.83,3.81 32.83,7.62 32.19,8.26 17.91,8.26 17.27,7.62 17.27,3.18 IC1.D1
N$18
  Bottom 0.152: IC1.E3 19.81,5.71 32.19,5.71 32.51,5.4 32.51,3.49 34.1,1.91 75.69,1.91 76.64,2.86 84.26,2.86 PCB1.10
N$19
  Bottom 0.152: IC1.F2 22.35,3.18 32.19,3.18 33.78,1.59 85.53,1.59 PCB1.9
N$20
  Bottom 0.152: PCB1.8 5.84,5.71 9.65,5.71 IC1.B2
N$21
  Bottom 0.152: IC1.A4 PCB1.6
N$22
  Bottom 0.152: IC1.B4 9.65,8.26 5.84,8.26 PCB1.7
N$23  (via drill 0.4)
  Route2 0.152: IC1.B1 12.19,3.18 13.78,3.18 14.73,4.13 14.73,14.29 19.18,18.73 23.62,18.73 v24.57,17.78
  Bottom 0.152: v24.57,17.78 23.89,17.78 SW1.6 23.62,17.51 23.62,16.83 19.81,13.02 19.81,10.96 R3.2
N$24
  Bottom 0.152: PCB1.11 86.81,7.94 82.36,7.94 81.41,6.99 T1.3
N$25
  Bottom 0.152: T1.1 79.82,6.03 81.56,4.29 R6.2
N$29  (via drill 0.4)
  Route2 0.152: IC1.F1 19.81,3.18 19.81,7.94 19.18,8.57 19.18,17.14 v19.81,17.78
  Bottom 0.152: SW1.5 22.67,18.26 22.35,18.57 20.61,18.57 v19.81,17.78 18.71,17.78 R4.2
N$30  (via drill 0.4)
  Route2 0.152: IC1.D2 17.27,5.71 17.27,16.19 19.49,18.41 20.13,18.41 v20.76,17.78
  Bottom 0.152: v20.76,17.78 21.44,17.78 SW1.4 21.67,16.46 21.08,15.88 17.42,15.88 R8.2
RD  (via drill 0.4)
  Top 0.152: IC5.22 43.62,13.65 44.26,13.02 v44.26,3.81 44.26,3.18 43.62,2.54 IC7.22 | IC4.22 64.58,13.65 65.21,13.02 v65.21,3.81 65.21,3.18 64.58,2.54 IC6.22
  Route15 0.152: v65.21,3.81 v44.26,3.81 33.46,14.61 33.46,18.73 31.56,20.64 19.49,20.64 IC1.E8
VCC  (via drill 0.4)
  Top 0.152: 53.34,5.27 C2.1 | 53.34,18.6 C3.1 | IC1.H4 25.21,10.48 25.21,18.1 24.89,18.41 23.3,18.41 21.4,16.51 21.4,15.88 D2.3
  Top 0.406: 53.34,5.27 v51.24,3.18 IC7.28 | 53.34,18.6 v51.24,16.51 IC5.28 | IC2.20 v83.31,25.72 | IC3.20 v83.31,12.38 | IC6.28 v72.2,3.18 | IC4.28 v72.2,16.51
  Bottom 0.152: D1.3 81.09,17.14 80.14,16.19 80.14,13.46 C4.1 81.73,12.07 82.04,12.38 | IC1.H4 C1.1 23.62,9.97 | 16,14.61 R8.1 16,13.34 | R3.1 18.22,13.34 | 18.22,13.34 16,13.34 | 16,13.34 14.73,13.34 IC1.C5 | R4.1 18.22,13.34
  Bottom 0.406: v83.31,12.38 82.04,12.38
  pour Route3 (isolate 0.127): 2.98,0 89.98,0 89.98,26.67 2.98,26.67
WR0  (via drill 0.4)
  Top 0.152: IC4.27 v70.93,16.51
  Route15 0.152: v70.93,16.51 70.29,15.88 52.83,15.88 51.56,17.14 49.66,17.14 49.34,16.83 41.09,16.83 40.45,17.46 37.91,17.46 31.88,23.5 17.27,23.5 IC1.D10
WR1  (via drill 0.4)
  Top 0.152: v49.98,16.51 IC5.27
  Route15 0.152: v49.98,16.51 40.77,16.51 40.13,17.14 37.59,17.14 31.56,23.18 16.95,23.18 16.32,23.81 14.41,23.81 IC1.C10
WR2  (via drill 0.4)
  Top 0.152: IC6.27 v70.93,3.18
  Route15 0.152: v70.93,3.18 70.29,2.54 40.45,2.54 32.83,10.16 32.83,16.83 31.24,18.41 17.91,18.41 16.95,19.37 16.95,21.27 IC1.D9
WR3  (via drill 0.4)
  Top 0.152: v49.98,3.18 IC7.27
  Route15 0.152: v49.98,3.18 40.45,3.18 33.15,10.48 33.15,17.14 31.56,18.73 18.22,18.73 17.27,19.69 17.27,22.23 16,23.5 12.19,23.5 IC1.B10

### Text on the board
Bottom: STN TM-2.1